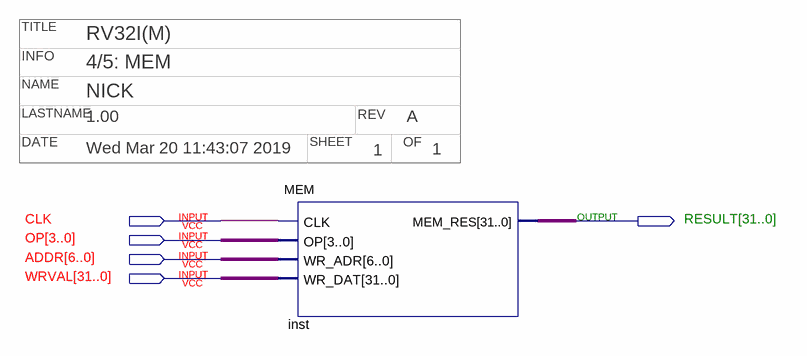
[diagram p0: schematic sheet]
// Quartus schematic MEMTEST.bdf as structural Verilog: 1 symbols, 5 pins
// Title block: TITLE: RV32I(M); INFO: 4/5: MEM; NAME: NICK; LASTNAME: 1.00; REV: A; DATE: Wed Mar 20 11:43:07 2019; SHEET: 1; OF: 1
module MEMTEST (
  input  CLK,
  input  [3:0] OP,
  input  [6:0] ADDR,
  input  [31:0] WRVAL,
  output [31:0] RESULT
);

  MEM inst (.CLK(CLK), .OP(OP), .WR_ADR(ADDR), .WR_DAT(WRVAL), .MEM_RES(RESULT));
endmodule
